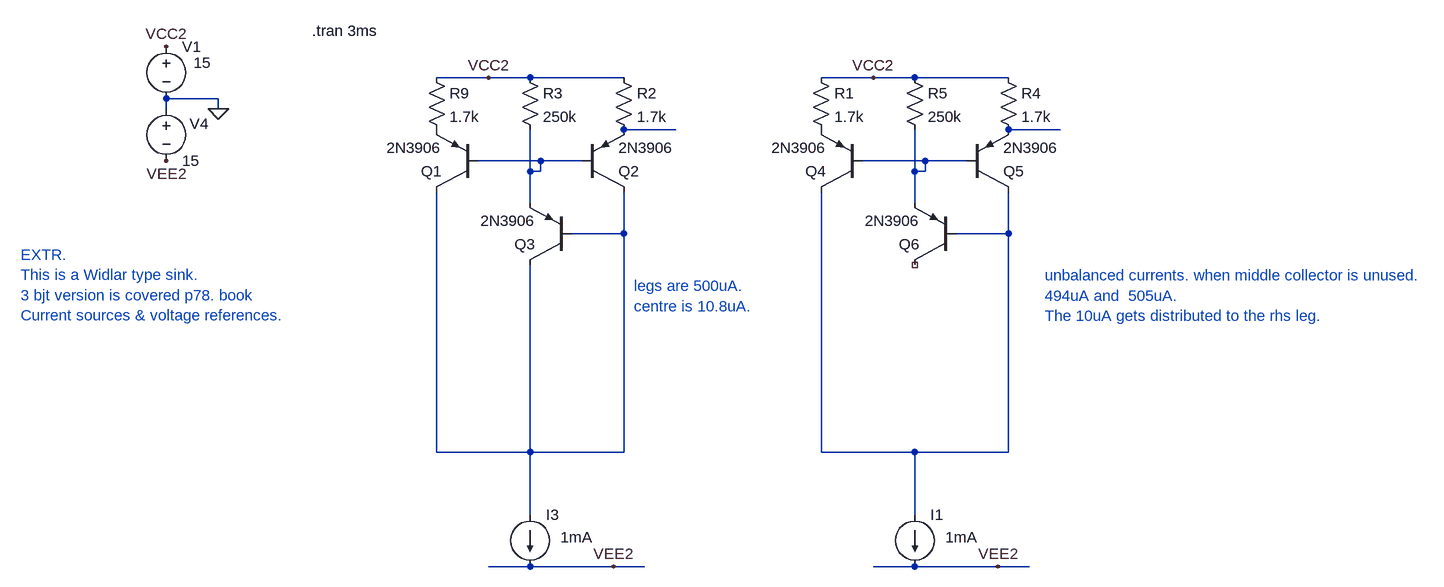
[diagram p0: schematic Draft55.asc]
Draft55.asc, the LTspice schematic file:
Version 4
SHEET 1 2428 952
WIRE 96 -320 16 -320
WIRE 160 -320 96 -320
WIRE 304 -320 160 -320
WIRE 688 -320 608 -320
WIRE 752 -320 688 -320
WIRE 896 -320 752 -320
WIRE -320 -288 -400 -288
WIRE -400 -272 -400 -288
WIRE -320 -272 -320 -288
WIRE 384 -240 304 -240
WIRE 976 -240 896 -240
WIRE 176 -192 80 -192
WIRE 240 -192 176 -192
WIRE 768 -192 672 -192
WIRE 832 -192 768 -192
WIRE 160 -176 160 -240
WIRE 176 -176 176 -192
WIRE 176 -176 160 -176
WIRE 752 -176 752 -240
WIRE 768 -176 768 -192
WIRE 768 -176 752 -176
WIRE 160 -128 160 -176
WIRE 752 -128 752 -176
WIRE 304 -80 304 -144
WIRE 304 -80 224 -80
WIRE 896 -80 896 -144
WIRE 896 -80 816 -80
WIRE 16 256 16 -144
WIRE 160 256 160 -32
WIRE 160 256 16 256
WIRE 304 256 304 -80
WIRE 304 256 160 256
WIRE 608 256 608 -144
WIRE 752 256 608 256
WIRE 896 256 896 -80
WIRE 896 256 752 256
WIRE 160 352 160 256
WIRE 752 352 752 256
WIRE 160 432 96 432
WIRE 288 432 160 432
WIRE 336 432 288 432
WIRE 752 432 688 432
WIRE 880 432 752 432
WIRE 928 432 880 432
FLAG -320 -272 0
FLAG -400 -368 VCC2
FLAG -400 -192 VEE2
FLAG 96 -320 VCC2
FLAG 288 432 VEE2
FLAG 688 -320 VCC2
FLAG 880 432 VEE2
SYMBOL voltage -400 -384 R0
WINDOW 123 0 0 Left 0
WINDOW 39 0 0 Left 0
WINDOW 3 42 41 Left 2
SYMATTR Value 15
SYMATTR InstName V1
SYMBOL voltage -400 -288 R0
WINDOW 123 0 0 Left 0
WINDOW 39 0 0 Left 0
WINDOW 0 36 39 Left 2
SYMATTR InstName V4
SYMATTR Value 15
SYMBOL res 0 -336 R0
SYMATTR InstName R9
SYMATTR Value 1.7k
SYMBOL current 160 352 R0
WINDOW 123 0 0 Left 0
WINDOW 39 0 0 Left 0
WINDOW 3 47 35 Left 2
SYMATTR Value 1mA
SYMATTR InstName I3
SYMBOL res 288 -336 R0
SYMATTR InstName R2
SYMATTR Value 1.7k
SYMBOL res 144 -336 R0
SYMATTR InstName R3
SYMATTR Value 250k
SYMBOL pnp 80 -144 R180
SYMATTR InstName Q1
SYMATTR Value 2N3906
SYMBOL pnp 240 -144 M180
SYMATTR InstName Q2
SYMATTR Value 2N3906
SYMBOL pnp 224 -32 R180
SYMATTR InstName Q3
SYMATTR Value 2N3906
SYMBOL res 592 -336 R0
SYMATTR InstName R1
SYMATTR Value 1.7k
SYMBOL current 752 352 R0
WINDOW 123 0 0 Left 0
WINDOW 39 0 0 Left 0
WINDOW 3 47 35 Left 2
SYMATTR Value 1mA
SYMATTR InstName I1
SYMBOL res 880 -336 R0
SYMATTR InstName R4
SYMATTR Value 1.7k
SYMBOL res 736 -336 R0
SYMATTR InstName R5
SYMATTR Value 250k
SYMBOL pnp 672 -144 R180
SYMATTR InstName Q4
SYMATTR Value 2N3906
SYMBOL pnp 832 -144 M180
SYMATTR InstName Q5
SYMATTR Value 2N3906
SYMBOL pnp 816 -32 R180
SYMATTR InstName Q6
SYMATTR Value 2N3906
TEXT -176 -392 Left 2 !.tran 3ms
TEXT 320 0 Left 2 ;legs are 500uA.\ncentre is 10.8uA.
TEXT 952 -16 Left 2 ;unbalanced currents. when middle collector is unused.\n494uA and  505uA.   \nThe 10uA gets distributed to the rhs leg.
TEXT -624 -48 Left 2 ;EXTR. \nThis is a Widlar type sink.\n3 bjt version is covered p78. book\nCurrent sources & voltage references.

The netlist it stands for:
* Draft55.asc
V1 VCC2 0 15
V4 0 VEE2 15
R9 VCC2 P001 1.7k
I3 N005 VEE2 1mA
R2 VCC2 N001 1.7k
R3 VCC2 N003 250k
Q1 N005 N003 P001 0 2N3906
Q2 N005 N003 N001 0 2N3906
Q3 N005 N005 N003 0 2N3906
R1 VCC2 P002 1.7k
I1 N006 VEE2 1mA
R4 VCC2 N002 1.7k
R5 VCC2 N004 250k
Q4 N006 N004 P002 0 2N3906
Q5 N006 N004 N002 0 2N3906
Q6 NC_01 N006 N004 0 2N3906
.model NPN NPN
.model PNP PNP
.lib standard.bjt
.tran 3ms
* legs are 500uA.
* centre is 10.8uA.
* unbalanced currents. when middle collector is unused.
* 494uA and  505uA.
* The 10uA gets distributed to the rhs leg.
* EXTR.
* This is a Widlar type sink.
* 3 bjt version is covered p78. book
* Current sources & voltage references.
.backanno
.end